# Altium project Pedal_SOM_MCU.PrjPcb
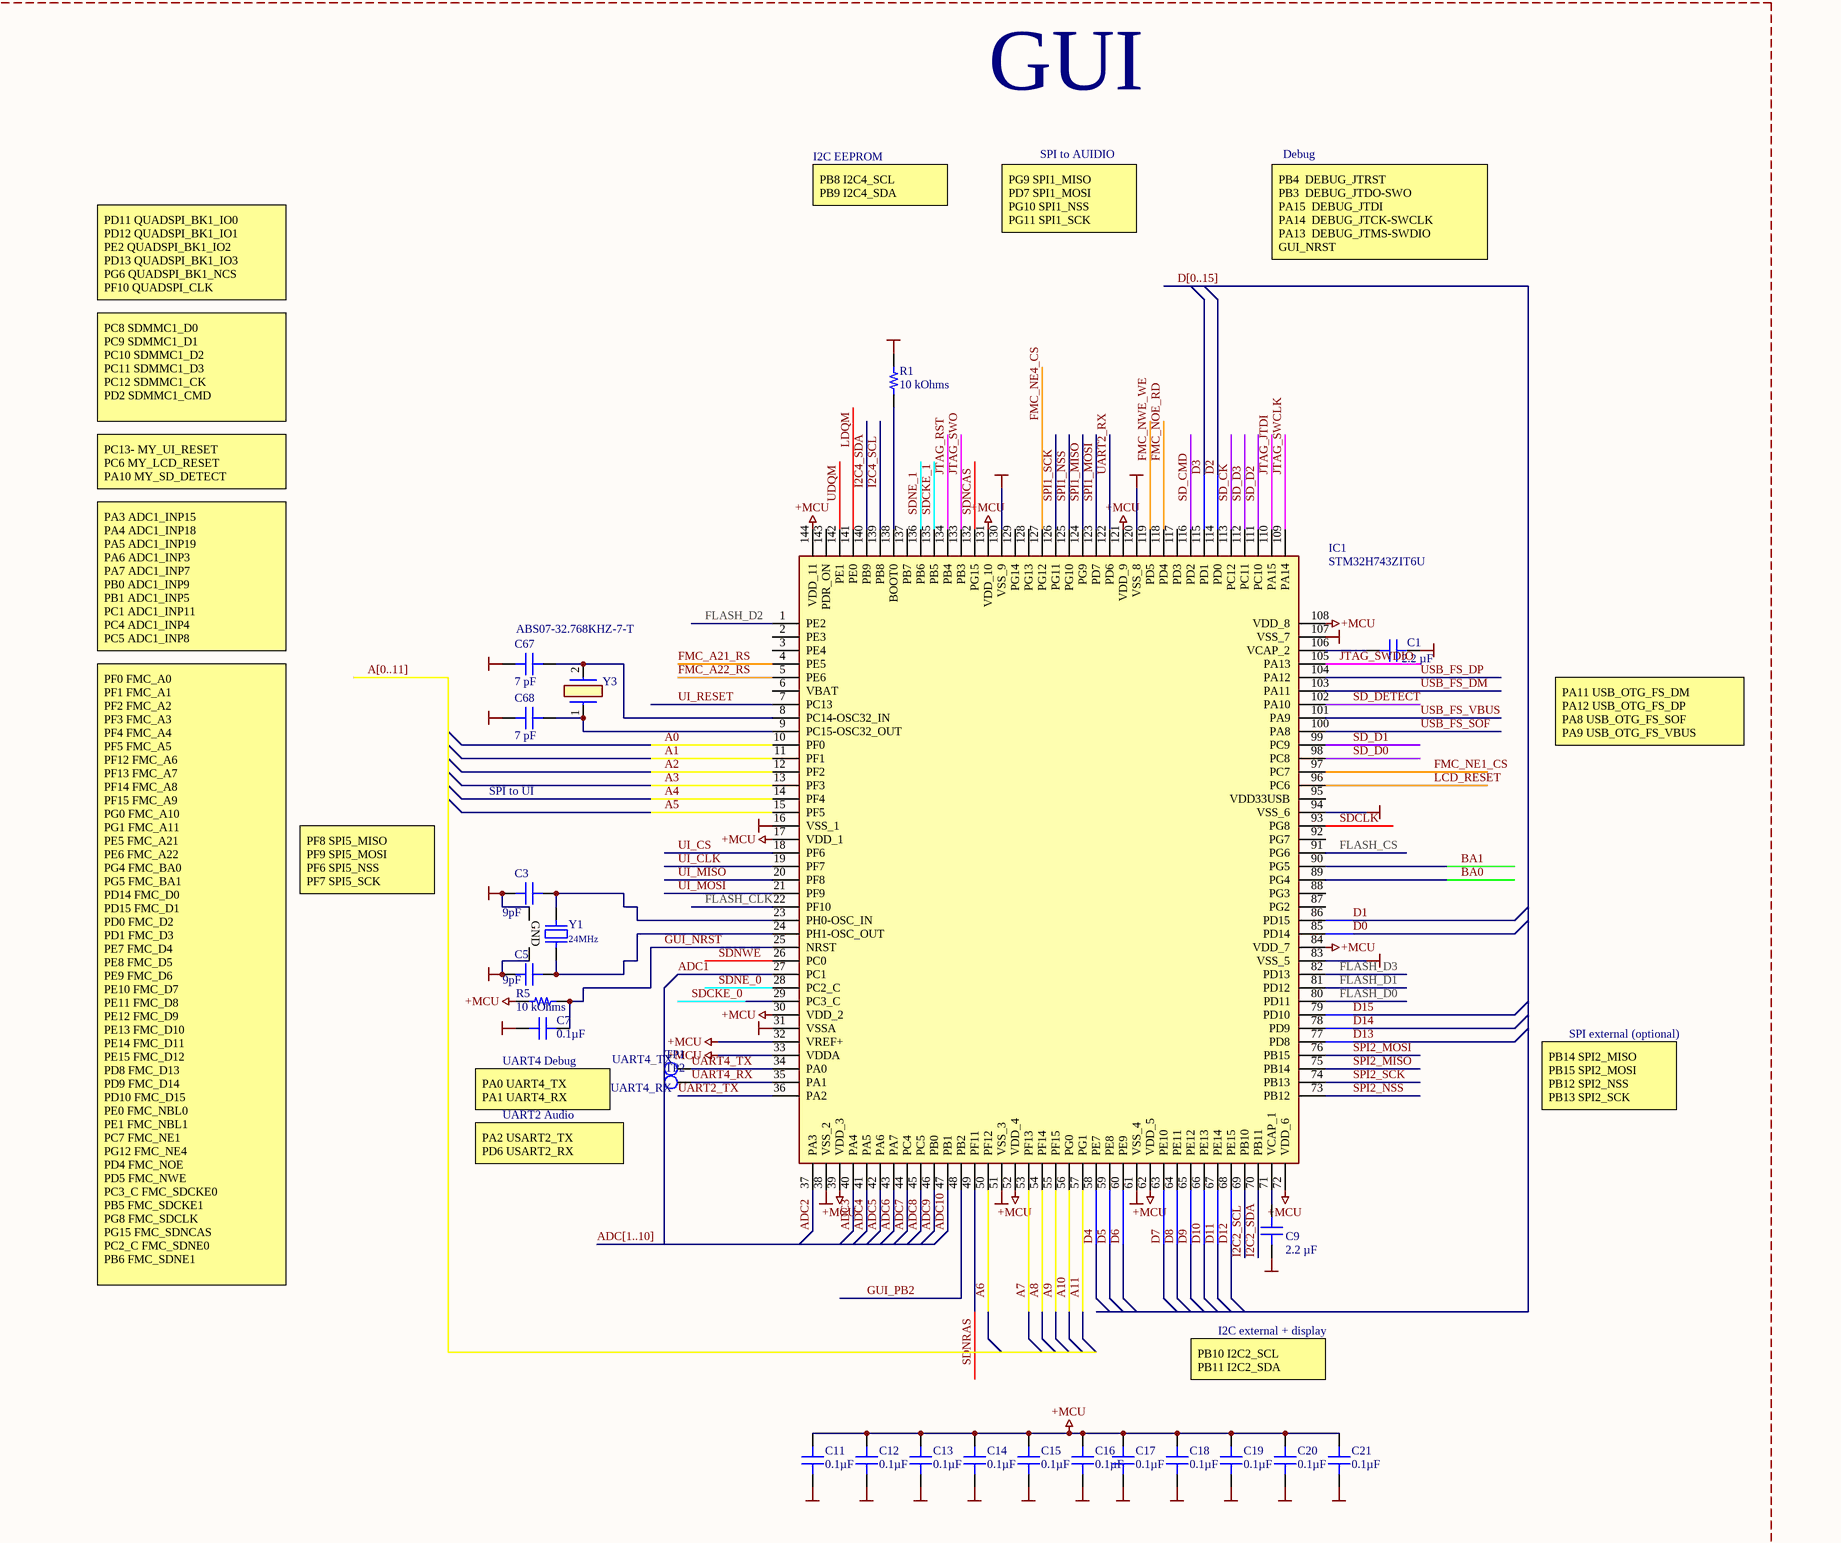
[diagram p0: SOM_MCU.SchDoc, top left]
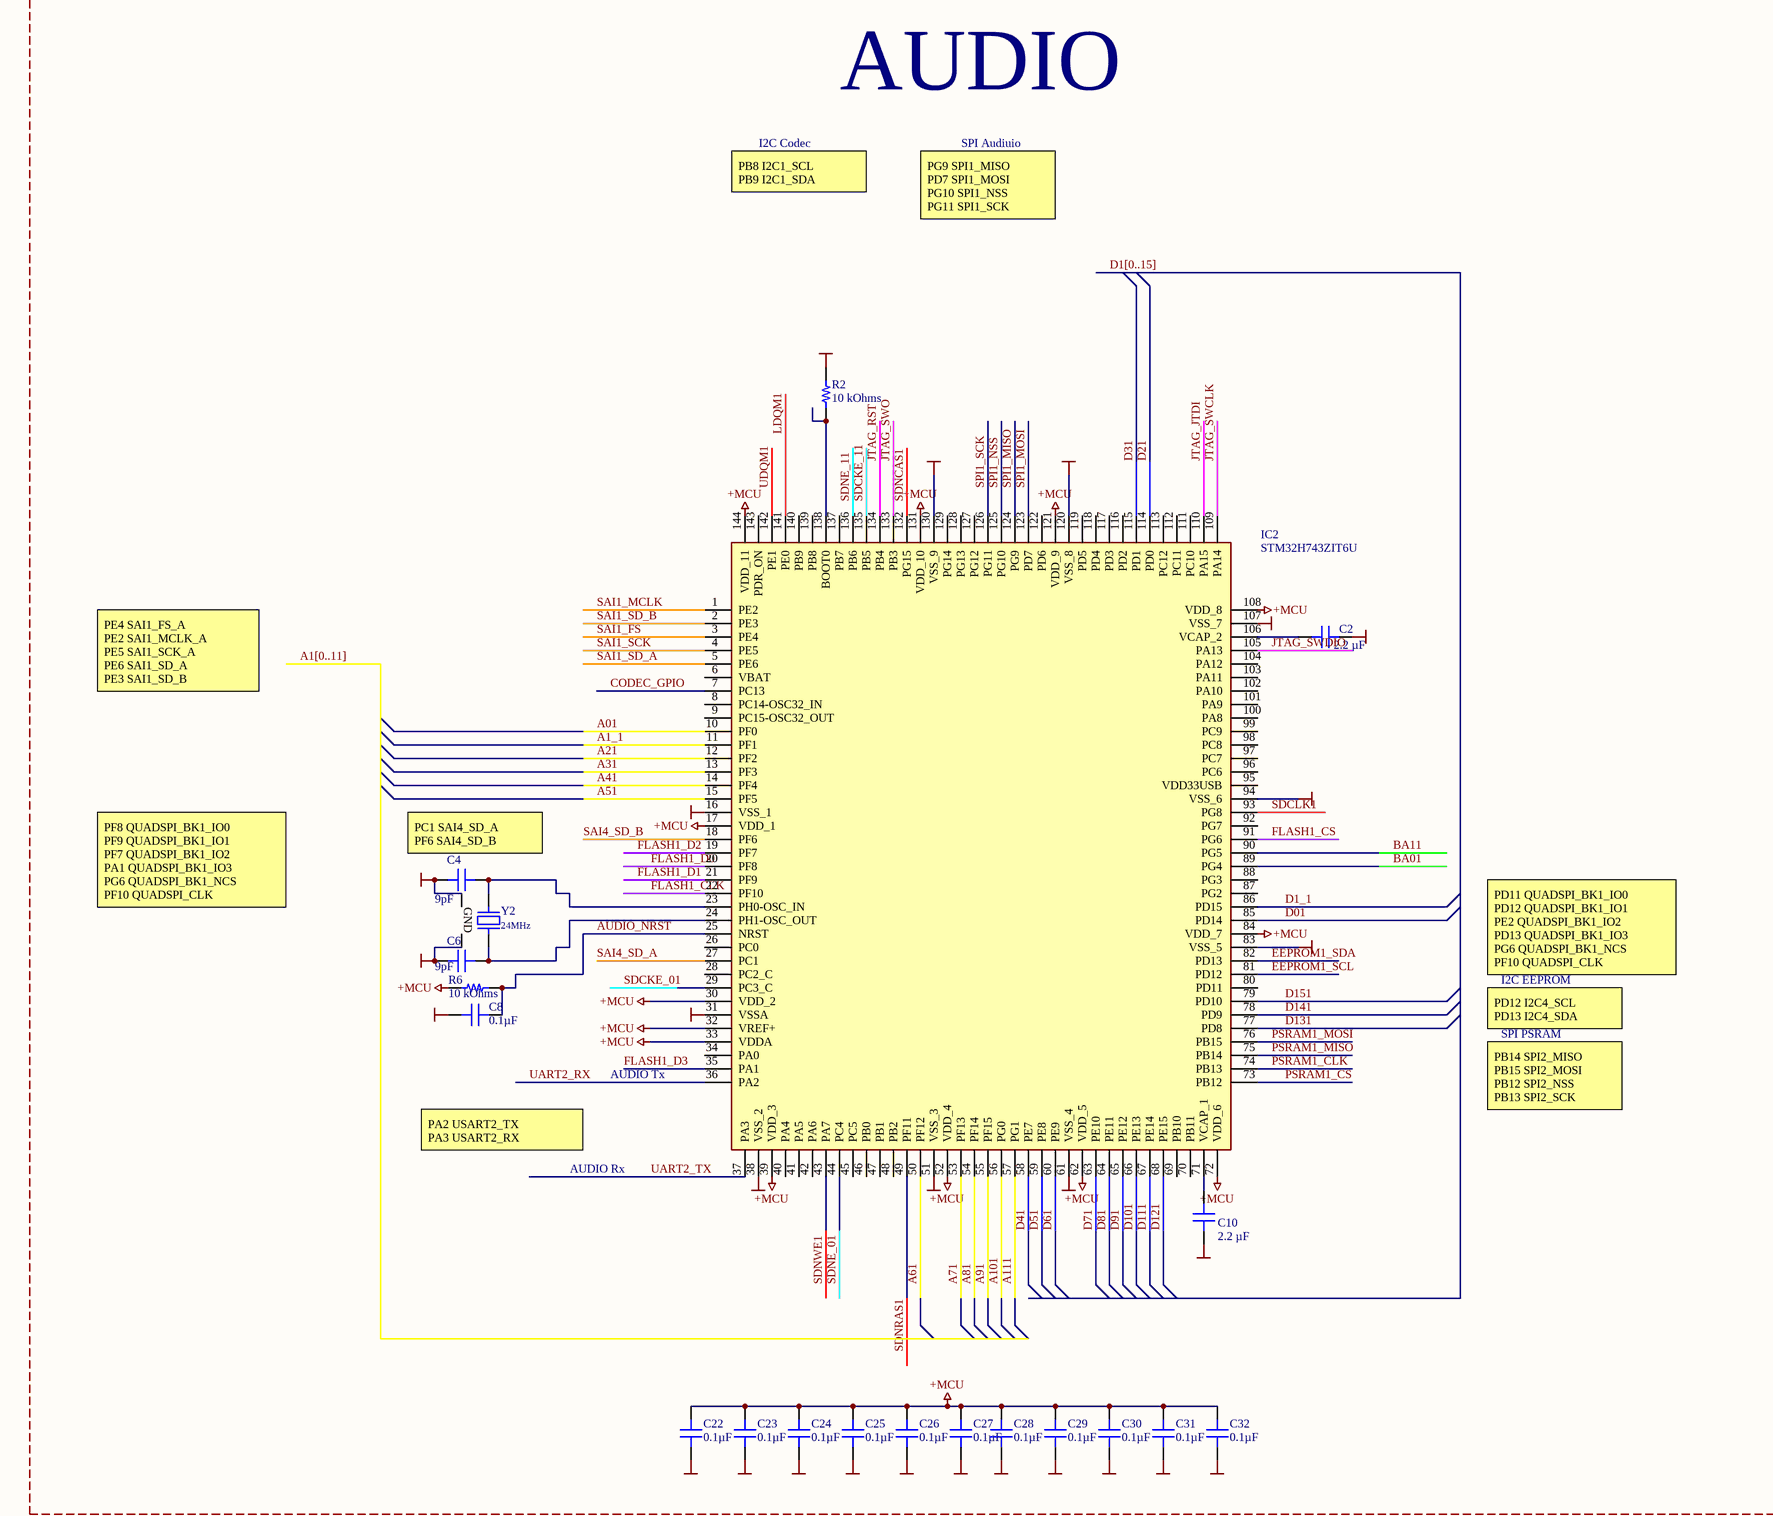
[diagram p1: SOM_MCU.SchDoc, top right]
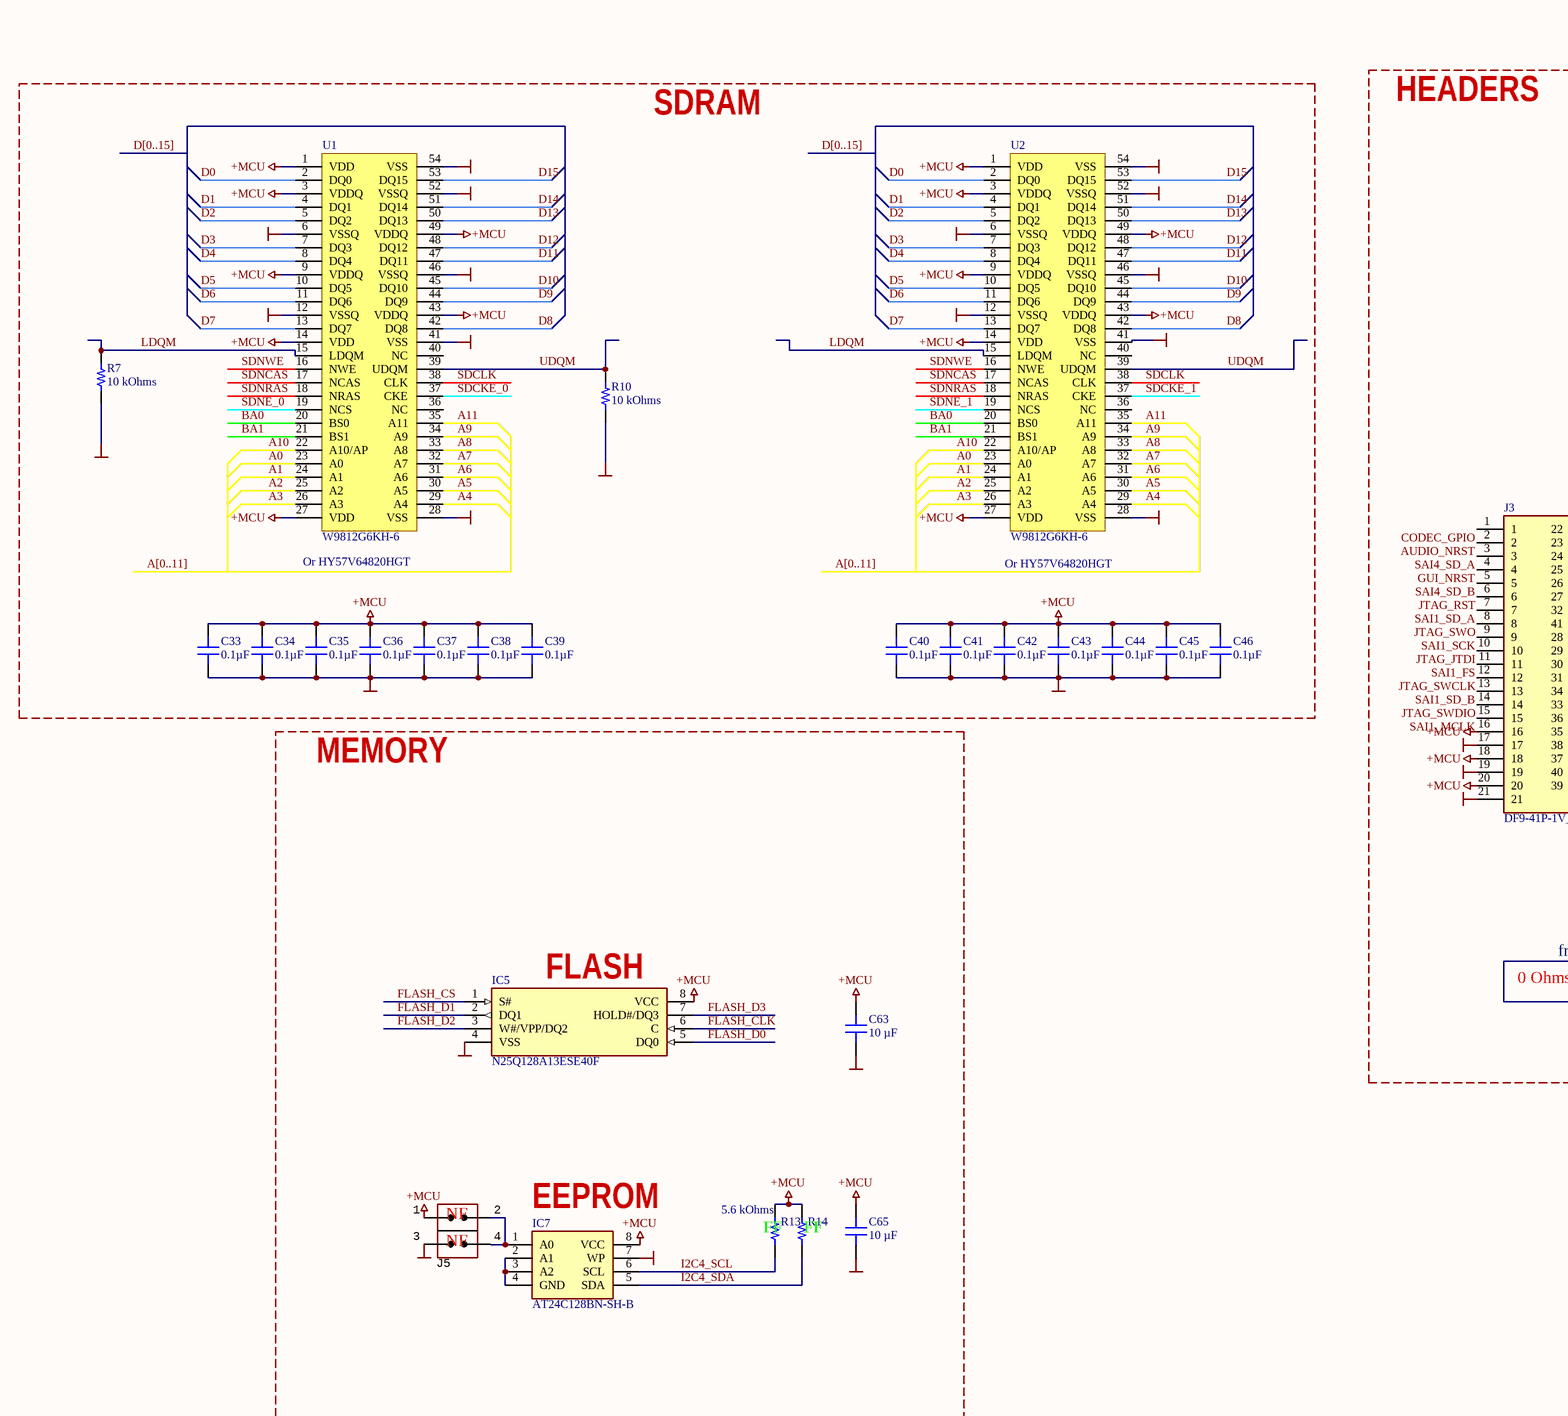
[diagram p2: SOM_MCU.SchDoc, bottom left]
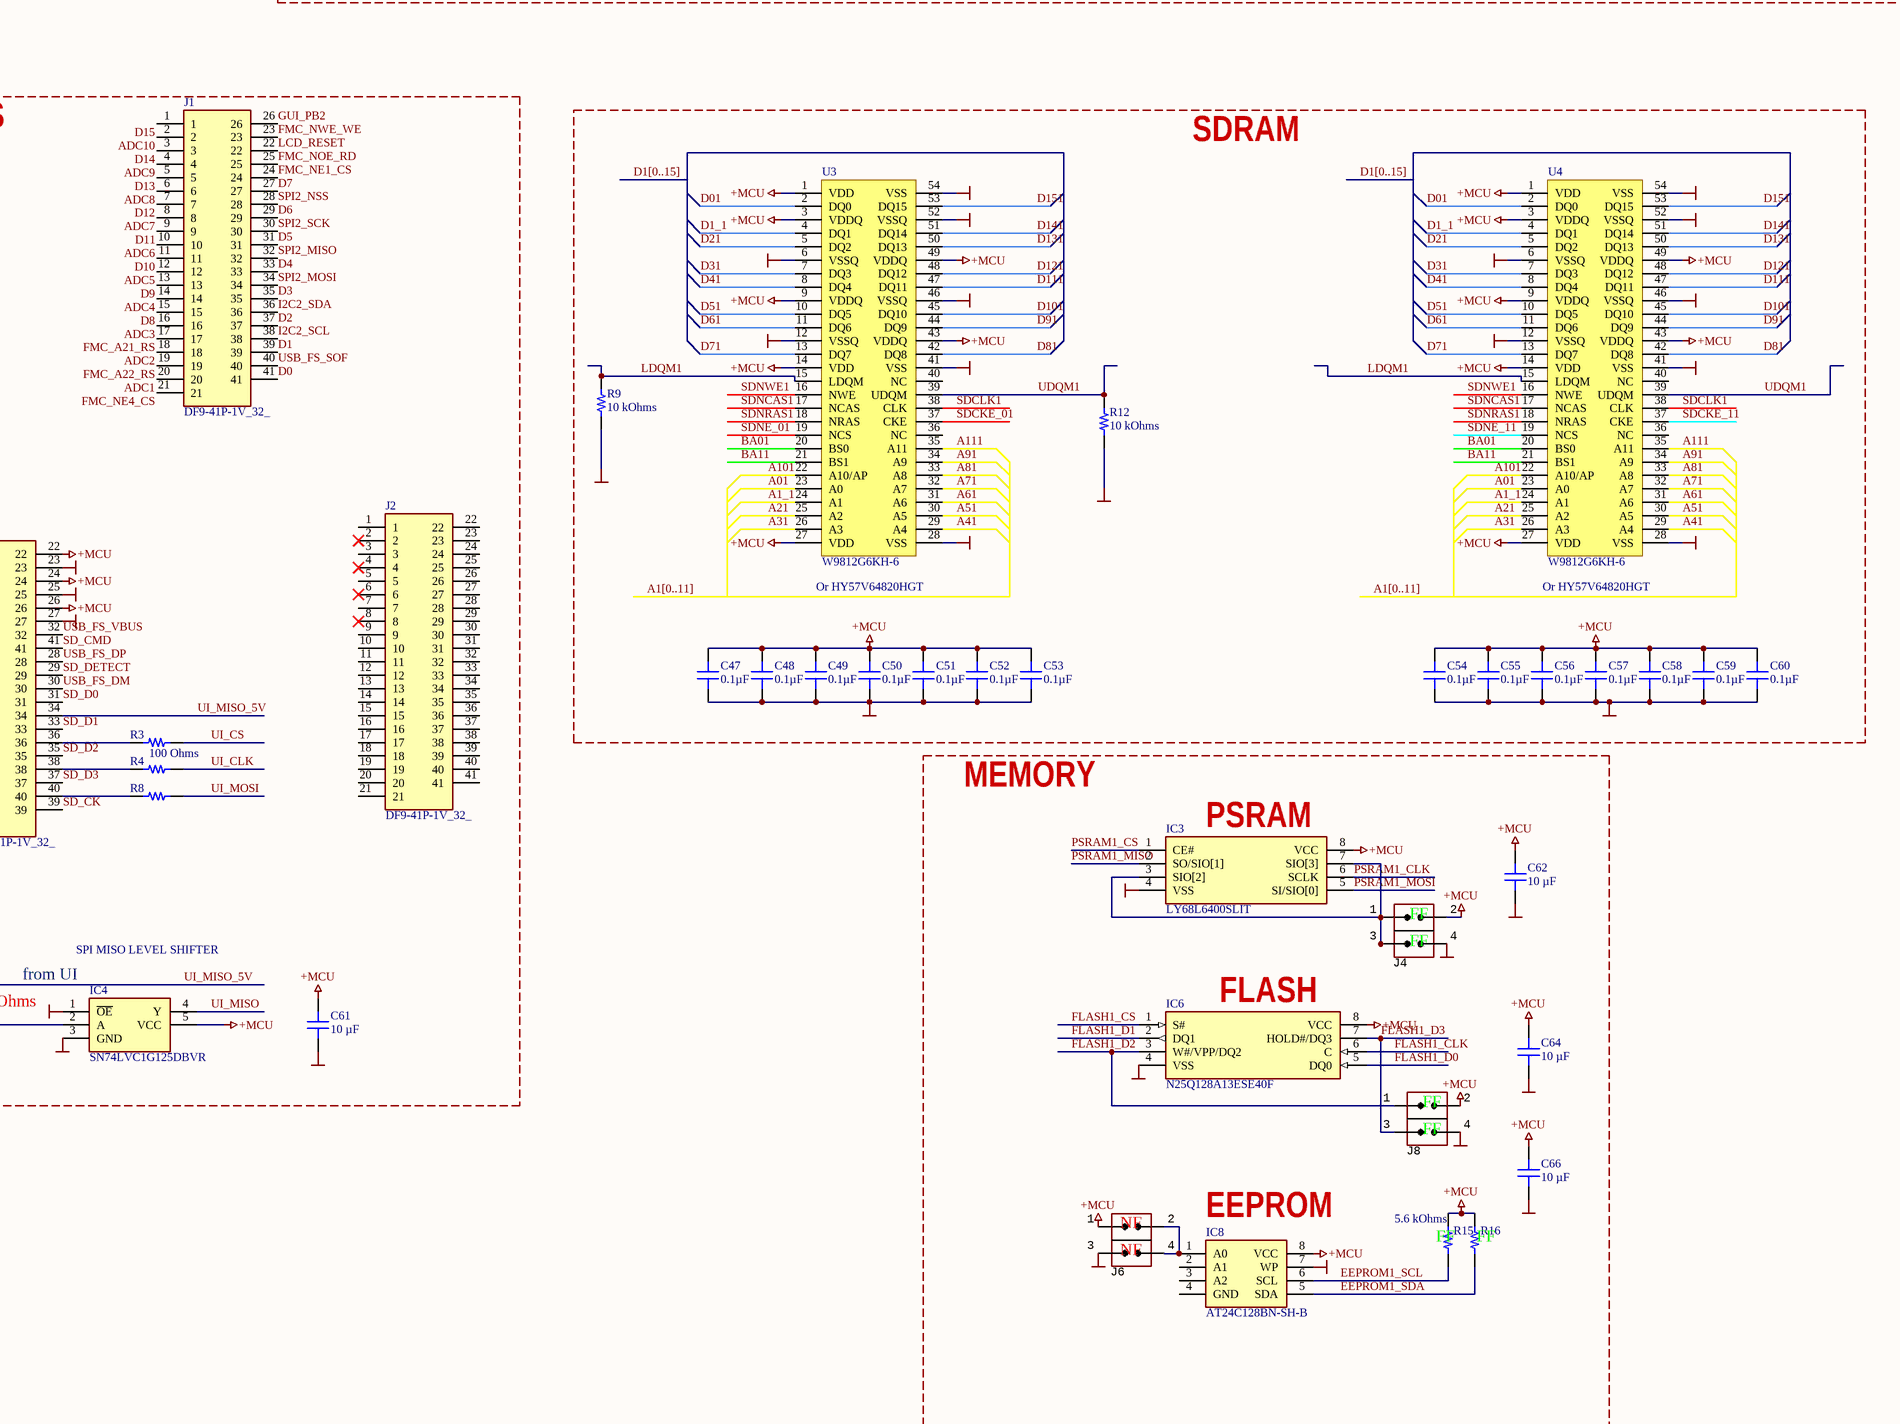
[diagram p3: SOM_MCU.SchDoc, bottom right]
1 sheet, 107 parts. Net scope: global (net labels, ports and power ports of the same name join across sheets).
Board files: SOM_MCU.PcbDoc, snapshots.PcbDoc, SOM_MCU_dual.PcbDoc

## Sheet SOM_MCU.SchDoc
size A0; SheetNumber: 1; SheetTotal: 1

### Parts
C1  2.2 µF  [CAP 0805_2012]
C2  2.2 µF  [CAP 0805_2012]
C3  9pF  [CAP 0805_2012]
C4  9pF  [CAP 0805_2012]
C5  9pF  [CAP 0805_2012]
C6  9pF  [CAP 0805_2012]
C7  0.1µF  [CAP 0402_1005]
C8  0.1µF  [CAP 0402_1005]
C9  2.2 µF  [CAP 0805_2012]
C10  2.2 µF  [CAP 0805_2012]
C11  0.1µF  [CAP 0402_1005]
C12  0.1µF  [CAP 0402_1005]
C13  0.1µF  [CAP 0402_1005]
C14  0.1µF  [CAP 0402_1005]
C15  0.1µF  [CAP 0402_1005]
C16  0.1µF  [CAP 0402_1005]
C17  0.1µF  [CAP 0402_1005]
C18  0.1µF  [CAP 0402_1005]
C19  0.1µF  [CAP 0402_1005]
C20  0.1µF  [CAP 0402_1005]
C21  0.1µF  [CAP 0402_1005]
C22  0.1µF  [CAP 0402_1005]
C23  0.1µF  [CAP 0402_1005]
C24  0.1µF  [CAP 0402_1005]
C25  0.1µF  [CAP 0402_1005]
C26  0.1µF  [CAP 0402_1005]
C27  0.1µF  [CAP 0402_1005]
C28  0.1µF  [CAP 0402_1005]
C29  0.1µF  [CAP 0402_1005]
C30  0.1µF  [CAP 0402_1005]
C31  0.1µF  [CAP 0402_1005]
C32  0.1µF  [CAP 0402_1005]
C33  0.1µF  [CAP 0402_1005]
C34  0.1µF  [CAP 0402_1005]
C35  0.1µF  [CAP 0402_1005]
C36  0.1µF  [CAP 0402_1005]
C37  0.1µF  [CAP 0402_1005]
C38  0.1µF  [CAP 0402_1005]
C39  0.1µF  [CAP 0402_1005]
C40  0.1µF  [CAP 0402_1005]
C41  0.1µF  [CAP 0402_1005]
C42  0.1µF  [CAP 0402_1005]
C43  0.1µF  [CAP 0402_1005]
C44  0.1µF  [CAP 0402_1005]
C45  0.1µF  [CAP 0402_1005]
C46  0.1µF  [CAP 0402_1005]
C47  0.1µF  [CAP 0402_1005]
C48  0.1µF  [CAP 0402_1005]
C49  0.1µF  [CAP 0402_1005]
C50  0.1µF  [CAP 0402_1005]
C51  0.1µF  [CAP 0402_1005]
C52  0.1µF  [CAP 0402_1005]
C53  0.1µF  [CAP 0402_1005]
C54  0.1µF  [CAP 0402_1005]
C55  0.1µF  [CAP 0402_1005]
C56  0.1µF  [CAP 0402_1005]
C57  0.1µF  [CAP 0402_1005]
C58  0.1µF  [CAP 0402_1005]
C59  0.1µF  [CAP 0402_1005]
C60  0.1µF  [CAP 0402_1005]
C61  10 µF  [CAP 0805_2012]
C62  10 µF  [CAP 0805_2012]
C63  10 µF  [CAP 0805_2012]
C64  10 µF  [CAP 0805_2012]
C65  10 µF  [CAP 0805_2012]
C66  10 µF  [CAP 0805_2012]
C67  7 pF  [CAP 0805_2012]
C68  7 pF  [CAP 0805_2012]
IC1  STM32H743ZIT6U  [QFP50P2200X2200X160-144N]
IC2  STM32H743ZIT6U  [QFP50P2200X2200X160-144N]
IC3  LY68L6400SLIT  [SOIC127P600X175-8N]
IC4  SN74LVC1G125DBVR  [SOT95P280X145-5N]
IC5  N25Q128A13ESE40F  [SOIC127P790X216-8N]
IC6  N25Q128A13ESE40F  [SOIC127P790X216-8N]
IC7  AT24C128BN-SH-B  [SOIC127P600X175-8N]
IC8  AT24C128BN-SH-B  [SOIC127P600X175-8N]
J1  DF9-41P-1V_32_  [HIROSE_DF9-41P-1V(32)]
J2  DF9-41P-1V_32_  [HIROSE_DF9-41P-1V(32)]
J3  DF9-41P-1V_32_  [HIROSE_DF9-41P-1V(32)]
J4  (no value)  [CON: JUMPER x2]
J5  (no value)  [CON: JUMPER x2]
J6  (no value)  [CON: JUMPER x2]
J8  (no value)  [CON: JUMPER x2]
R1  10 kOhms  [RES 0603_1608]
R2  10 kOhms  [RES 0603_1608]
R3  100 Ohms  [RES 0402_1005]
R4  100 Ohms  [RES 0402_1005]  (value not drawn)
R5  10 kOhms  [RES 0603_1608]
R6  10 kOhms  [RES 0603_1608]
R7  10 kOhms  [RES 0603_1608]
R8  100 Ohms  [RES 0402_1005]  (value not drawn)
R9  10 kOhms  [RES 0603_1608]
R10  10 kOhms  [RES 0603_1608]
R12  10 kOhms  [RES 0603_1608]
R13  5.6 kOhms  [RES 0603_1608]
R14  5.6 kOhms  [RES 0603_1608]  (value not drawn)
R15  5.6 kOhms  [RES 0603_1608]
R16  5.6 kOhms  [RES 0603_1608]  (value not drawn)
TP1  UART4_TX  [TESTPOINT_VIA]
TP2  UART4_RX  [TESTPOINT_VIA]
U1  W9812G6KH-6  [TSOP-54]
U2  W9812G6KH-6  [TSOP-54]
U3  W9812G6KH-6  [TSOP-54]
U4  W9812G6KH-6  [TSOP-54]
Y1  24MHz  [NDK NX3225SA]
Y2  24MHz  [NDK NX3225SA]
Y3  ABS07-32.768KHZ-7-T  [ABS07]

### Blocks framed on the sheet
AUDIO: C2 C4 C6 C8 C10 C22-C32 IC2 R2 R6 Y2
GUI: C1 C3 C5 C7 C9 C11-C21 C67 C68 IC1 R1 R5 TP1 TP2 Y1 Y3
SDRAM: C33-C46 R7 R10 U1 U2
HEADERS: C61 IC4 J1-J3 R3 R4 R8
SDRAM: C47-C60 R9 R12 U3 U4

### Nets
+MCU: C11.1 C12.1 C13.1 C14.1 C15.1 C16.1 C17.1 C18.1 C19.1 C20.1 C21.1 C22.1 C23.1 C24.1 C25.1 C26.1 C27.1 C28.1 C29.1 C30.1 C31.1 C32.1 C33.1 C34.1 C35.1 C36.1 C37.1 C38.1 C39.1 C40.1 C41.1 C42.1 C43.1 C44.1 C45.1 C46.1 C47.1 C48.1 C49.1 C50.1 C51.1 C52.1 C53.1 C54.1 C55.1 C56.1 C57.1 C58.1 C59.1 C60.1 C61.2 C62.2 C63.2 C64.2 C65.2 C66.2 IC1.17(VDD_1) IC1.30(VDD_2) IC1.32(VREF+) IC1.33(VDDA) IC1.39(VDD_3) IC1.52(VDD_4) IC1.62(VDD_5) IC1.72(VDD_6) IC1.84(VDD_7) IC1.108(VDD_8) IC1.121(VDD_9) IC1.131(VDD_10) IC1.144(VDD_11) IC2.17(VDD_1) IC2.30(VDD_2) IC2.32(VREF+) IC2.33(VDDA) IC2.39(VDD_3) IC2.52(VDD_4) IC2.62(VDD_5) IC2.72(VDD_6) IC2.84(VDD_7) IC2.108(VDD_8) IC2.121(VDD_9) IC2.131(VDD_10) IC2.144(VDD_11) IC3.8(VCC) IC4.5(VCC) IC5.8(VCC) IC6.8(VCC) IC7.8(VCC) IC8.8(VCC) J3.16 J3.18 J3.20 J3.22 J3.24 J3.26 J4.2(IN) J5.1(IN) J6.1(IN) J8.2(IN) R5.1 R6.1 R13.2 R14.2 R15.2 R16.2 U1.1(VDD) U1.3(VDDQ) U1.9(VDDQ) U1.14(VDD) U1.27(VDD) U1.43(VDDQ) U1.49(VDDQ) U2.1(VDD) U2.3(VDDQ) U2.9(VDDQ) U2.14(VDD) U2.27(VDD) U2.43(VDDQ) U2.49(VDDQ) U3.1(VDD) U3.3(VDDQ) U3.9(VDDQ) U3.14(VDD) U3.27(VDD) U3.43(VDDQ) U3.49(VDDQ) U4.1(VDD) U4.3(VDDQ) U4.9(VDDQ) U4.14(VDD) U4.27(VDD) U4.43(VDDQ) U4.49(VDDQ)
GND: C1.2 C2.2 C3.1 C4.1 C5.1 C6.1 C7.1 C8.1 C9.1 C10.1 C11.2 C12.2 C13.2 C14.2 C15.2 C16.2 C17.2 C18.2 C19.2 C20.2 C21.2 C22.2 C23.2 C24.2 C25.2 C26.2 C27.2 C28.2 C29.2 C30.2 C31.2 C32.2 C33.2 C34.2 C35.2 C36.2 C37.2 C38.2 C39.2 C40.2 C41.2 C42.2 C43.2 C44.2 C45.2 C46.2 C47.2 C48.2 C49.2 C50.2 C51.2 C52.2 C53.2 C54.2 C55.2 C56.2 C57.2 C58.2 C59.2 C60.2 C61.1 C62.1 C63.1 C64.1 C65.1 C66.1 C67.1 C68.1 IC1.16(VSS_1) IC1.31(VSSA) IC1.38(VSS_2) IC1.51(VSS_3) IC1.61(VSS_4) IC1.83(VSS_5) IC1.94(VSS_6) IC1.107(VSS_7) IC1.120(VSS_8) IC1.130(VSS_9) IC2.16(VSS_1) IC2.31(VSSA) IC2.38(VSS_2) IC2.51(VSS_3) IC2.61(VSS_4) IC2.83(VSS_5) IC2.94(VSS_6) IC2.107(VSS_7) IC2.120(VSS_8) IC2.130(VSS_9) IC3.4(VSS) IC4.1(~{OE}) IC4.3(GND) IC5.4(VSS) IC6.4(VSS) IC7.7(WP) IC8.7(WP) J3.17 J3.19 J3.21 J3.23 J3.25 J3.27 J4.4(IN) J5.3(IN) J6.3(IN) J8.4(IN) R1.2 R2.2 R7.1 R9.1 R10.1 R12.1 U1.6(VSSQ) U1.12(VSSQ) U1.28(VSS) U1.41(VSS) U1.46(VSSQ) U1.52(VSSQ) U1.54(VSS) U2.6(VSSQ) U2.12(VSSQ) U2.28(VSS) U2.41(VSS) U2.46(VSSQ) U2.52(VSSQ) U2.54(VSS) U3.6(VSSQ) U3.12(VSSQ) U3.28(VSS) U3.41(VSS) U3.46(VSSQ) U3.52(VSSQ) U3.54(VSS) U4.6(VSSQ) U4.12(VSSQ) U4.28(VSS) U4.41(VSS) U4.46(VSSQ) U4.52(VSSQ) U4.54(VSS) Y1.2(GND) Y1.4(GND) Y2.2(GND) Y2.4(GND)
A0: IC1.10(PF0) U1.23(A0) U2.23(A0)
A1: IC1.11(PF1) U1.24(A1) U2.24(A1)
A01: IC2.10(PF0) U3.23(A0) U4.23(A0)
A1_1: IC2.11(PF1) U3.24(A1) U4.24(A1)
A2: IC1.12(PF2) U1.25(A2) U2.25(A2)
A3: IC1.13(PF3) U1.26(A3) U2.26(A3)
A4: IC1.14(PF4) U1.29(A4) U2.29(A4)
A5: IC1.15(PF5) U1.30(A5) U2.30(A5)
A6: IC1.50(PF12) U1.31(A6) U2.31(A6)
A7: IC1.53(PF13) U1.32(A7) U2.32(A7)
A8: IC1.54(PF14) U1.33(A8) U2.33(A8)
A9: IC1.55(PF15) U1.34(A9) U2.34(A9)
A10: IC1.56(PG0) U1.22(A10/AP) U2.22(A10/AP)
A11: IC1.57(PG1) U1.35(A11) U2.35(A11)
A21: IC2.12(PF2) U3.25(A2) U4.25(A2)
A31: IC2.13(PF3) U3.26(A3) U4.26(A3)
A41: IC2.14(PF4) U3.29(A4) U4.29(A4)
A51: IC2.15(PF5) U3.30(A5) U4.30(A5)
A61: IC2.50(PF12) U3.31(A6) U4.31(A6)
A71: IC2.53(PF13) U3.32(A7) U4.32(A7)
A81: IC2.54(PF14) U3.33(A8) U4.33(A8)
A91: IC2.55(PF15) U3.34(A9) U4.34(A9)
A101: IC2.56(PG0) U3.22(A10/AP) U4.22(A10/AP)
A111: IC2.57(PG1) U3.35(A11) U4.35(A11)
ADC1: IC1.27(PC1) J1.20
ADC2: IC1.37(PA3) J1.18
ADC3: IC1.40(PA4) J1.16
ADC4: IC1.41(PA5) J1.14
ADC5: IC1.42(PA6) J1.12
ADC6: IC1.43(PA7) J1.10
ADC7: IC1.44(PC4) J1.8
ADC8: IC1.45(PC5) J1.6
ADC9: IC1.46(PB0) J1.4
ADC10: IC1.47(PB1) J1.2
AUDIO_NRST: C8.2 IC2.25(NRST) J3.2 R6.2
BA0: IC1.89(PG4) U1.20(BS0) U2.20(BS0)
BA1: IC1.90(PG5) U1.21(BS1) U2.21(BS1)
BA01: IC2.89(PG4) U3.20(BS0) U4.20(BS0)
BA11: IC2.90(PG5) U3.21(BS1) U4.21(BS1)
CODEC_GPIO: IC2.7(PC13) J3.1
D0: IC1.85(PD14) J1.41 U1.2(DQ0) U2.2(DQ0)
D1: IC1.86(PD15) J1.39 U1.4(DQ1) U2.4(DQ1)
D01: IC2.85(PD14) U3.2(DQ0) U4.2(DQ0)
D1_1: IC2.86(PD15) U3.4(DQ1) U4.4(DQ1)
D2: IC1.114(PD0) J1.37 U1.5(DQ2) U2.5(DQ2)
D3: IC1.115(PD1) J1.35 U1.7(DQ3) U2.7(DQ3)
D4: IC1.58(PE7) J1.33 U1.8(DQ4) U2.8(DQ4)
D5: IC1.59(PE8) J1.31 U1.10(DQ5) U2.10(DQ5)
D6: IC1.60(PE9) J1.29 U1.11(DQ6) U2.11(DQ6)
D7: IC1.63(PE10) J1.27 U1.13(DQ7) U2.13(DQ7)
D8: IC1.64(PE11) J1.15 U1.42(DQ8) U2.42(DQ8)
D9: IC1.65(PE12) J1.13 U1.44(DQ9) U2.44(DQ9)
D10: IC1.66(PE13) J1.11 U1.45(DQ10) U2.45(DQ10)
D11: IC1.67(PE14) J1.9 U1.47(DQ11) U2.47(DQ11)
D12: IC1.68(PE15) J1.7 U1.48(DQ12) U2.48(DQ12)
D13: IC1.77(PD8) J1.5 U1.50(DQ13) U2.50(DQ13)
D14: IC1.78(PD9) J1.3 U1.51(DQ14) U2.51(DQ14)
D15: IC1.79(PD10) J1.1 U1.53(DQ15) U2.53(DQ15)
D21: IC2.114(PD0) U3.5(DQ2) U4.5(DQ2)
D31: IC2.115(PD1) U3.7(DQ3) U4.7(DQ3)
D41: IC2.58(PE7) U3.8(DQ4) U4.8(DQ4)
D51: IC2.59(PE8) U3.10(DQ5) U4.10(DQ5)
D61: IC2.60(PE9) U3.11(DQ6) U4.11(DQ6)
D71: IC2.63(PE10) U3.13(DQ7) U4.13(DQ7)
D81: IC2.64(PE11) U3.42(DQ8) U4.42(DQ8)
D91: IC2.65(PE12) U3.44(DQ9) U4.44(DQ9)
D101: IC2.66(PE13) U3.45(DQ10) U4.45(DQ10)
D111: IC2.67(PE14) U3.47(DQ11) U4.47(DQ11)
D121: IC2.68(PE15) U3.48(DQ12) U4.48(DQ12)
D131: IC2.77(PD8) U3.50(DQ13) U4.50(DQ13)
D141: IC2.78(PD9) U3.51(DQ14) U4.51(DQ14)
D151: IC2.79(PD10) U3.53(DQ15) U4.53(DQ15)
EEPROM1_SCL: IC2.81(PD12) IC8.6(SCL) R15.1
EEPROM1_SDA: IC2.82(PD13) IC8.5(SDA) R16.1
FLASH1_CLK: IC2.22(PF10) IC6.6(C)
FLASH1_CS: IC2.91(PG6) IC6.1(S#)
FLASH1_D0: IC2.20(PF8) IC6.5(DQ0)
FLASH1_D1: IC2.21(PF9) IC6.2(DQ1)
FLASH1_D2: IC2.19(PF7) IC6.3(W#/VPP/DQ2) J8.1(IN)
FLASH1_D3: IC2.35(PA1) IC6.7(HOLD#/DQ3) J8.3(IN)
FLASH_CLK: IC1.22(PF10) IC5.6(C)
FLASH_CS: IC1.91(PG6) IC5.1(S#)
FLASH_D0: IC1.80(PD11) IC5.5(DQ0)
FLASH_D1: IC1.81(PD12) IC5.2(DQ1)
FLASH_D2: IC1.1(PE2) IC5.3(W#/VPP/DQ2)
FLASH_D3: IC1.82(PD13) IC5.7(HOLD#/DQ3)
FMC_A21_RS: IC1.4(PE5) J1.17
FMC_A22_RS: IC1.5(PE6) J1.19
FMC_NE1_CS: IC1.97(PC7) J1.24
FMC_NE4_CS: IC1.127(PG12) J1.21
FMC_NOE_RD: IC1.118(PD4) J1.25
FMC_NWE_WE: IC1.119(PD5) J1.23
GUI_NRST: C7.2 IC1.25(NRST) J3.4 R5.2
GUI_PB2: IC1.48(PB2) J1.26
I2C2_SCL: IC1.69(PB10) J1.38
I2C2_SDA: IC1.70(PB11) J1.36
I2C4_SCL: IC1.139(PB8) IC7.6(SCL) R13.1
I2C4_SDA: IC1.140(PB9) IC7.5(SDA) R14.1
JTAG_JTDI: IC1.110(PA15) IC2.110(PA15) J3.10
JTAG_RST: IC1.134(PB4) IC2.134(PB4) J3.6
JTAG_SWCLK: IC1.109(PA14) IC2.109(PA14) J3.12
JTAG_SWDIO: IC1.105(PA13) IC2.105(PA13) J3.14
JTAG_SWO: IC1.133(PB3) IC2.133(PB3) J3.8
LCD_RESET: IC1.96(PC6) J1.22
LDQM: IC1.141(PE0) R7.2 U1.15(LDQM) U2.15(LDQM)
LDQM1: IC2.141(PE0) R9.2 U3.15(LDQM) U4.15(LDQM)
PSRAM1_CLK: IC2.74(PB13) IC3.6(SCLK)
PSRAM1_CS: IC2.73(PB12) IC3.1(CE#)
PSRAM1_MISO: IC2.75(PB14) IC3.2(SO/SIO[1])
PSRAM1_MOSI: IC2.76(PB15) IC3.5(SI/SIO[0])
SAI1_FS: IC2.3(PE4) J3.11
SAI1_MCLK: IC2.1(PE2) J3.15
SAI1_SCK: IC2.4(PE5) J3.9
SAI1_SD_A: IC2.5(PE6) J3.7
SAI1_SD_B: IC2.2(PE3) J3.13
SAI4_SD_A: IC2.27(PC1) J3.3
SAI4_SD_B: IC2.18(PF6) J3.5
SD_CK: IC1.113(PC12) J3.39
SD_CMD: IC1.116(PD2) J3.41
SD_D0: IC1.98(PC8) J3.31
SD_D1: IC1.99(PC9) J3.33
SD_D2: IC1.111(PC10) J3.35
SD_D3: IC1.112(PC11) J3.37
SD_DETECT: IC1.102(PA10) J3.29
SDCKE_0: IC1.29(PC3_C) U1.37(CKE)
SDCKE_1: IC1.135(PB5) U2.37(CKE)
SDCKE_01: IC2.29(PC3_C) U3.37(CKE)
SDCKE_11: IC2.135(PB5) U4.37(CKE)
SDCLK: IC1.93(PG8) U1.38(CLK) U2.38(CLK)
SDCLK1: IC2.93(PG8) U3.38(CLK) U4.38(CLK)
SDNCAS: IC1.132(PG15) U1.17(NCAS) U2.17(NCAS)
SDNCAS1: IC2.132(PG15) U3.17(NCAS) U4.17(NCAS)
SDNE_0: IC1.28(PC2_C) U1.19(NCS)
SDNE_1: IC1.136(PB6) U2.19(NCS)
SDNE_01: IC2.44(PC4) U3.19(NCS)
SDNE_11: IC2.136(PB6) U4.19(NCS)
SDNRAS: IC1.49(PF11) U1.18(NRAS) U2.18(NRAS)
SDNRAS1: IC2.49(PF11) U3.18(NRAS) U4.18(NRAS)
SDNWE: IC1.26(PC0) U1.16(NWE) U2.16(NWE)
SDNWE1: IC2.43(PA7) U3.16(NWE) U4.16(NWE)
SPI1_MISO: IC1.124(PG9) IC2.124(PG9)
SPI1_MOSI: IC1.123(PD7) IC2.123(PD7)
SPI1_NSS: IC1.125(PG10) IC2.125(PG10)
SPI1_SCK: IC1.126(PG11) IC2.126(PG11)
SPI2_MISO: IC1.75(PB14) J1.32
SPI2_MOSI: IC1.76(PB15) J1.34
SPI2_NSS: IC1.73(PB12) J1.28
SPI2_SCK: IC1.74(PB13) J1.30
UART2_RX: IC1.122(PD6) IC2.36(PA2)
UART2_TX: IC1.36(PA2) IC2.37(PA3)
UART4_RX: IC1.35(PA1) TP2.1
UART4_TX: IC1.34(PA0) TP1.1
UDQM: IC1.142(PE1) R10.2 U1.39(UDQM) U2.39(UDQM)
UDQM1: IC2.142(PE1) R12.2 U3.39(UDQM) U4.39(UDQM)
UI_CLK: IC1.19(PF7) R4.2
UI_CS: IC1.18(PF6) R3.2
UI_MISO: IC1.20(PF8) IC4.4(Y)
UI_MISO_5V: IC4.2(A) J3.34
UI_MOSI: IC1.21(PF9) R8.2
UI_RESET: IC1.7(PC13)
USB_FS_DM: IC1.103(PA11) J3.30
USB_FS_DP: IC1.104(PA12) J3.28
USB_FS_SOF: IC1.100(PA8) J1.40
USB_FS_VBUS: IC1.101(PA9) J3.32
NetC1_1: C1.1 IC1.106(VCAP_2)
NetC2_1: C2.1 IC2.106(VCAP_2)
NetC3_2: C3.2 IC1.23(PH0-OSC_IN) Y1.1
NetC4_2: C4.2 IC2.23(PH0-OSC_IN) Y2.1
NetC5_2: C5.2 IC1.24(PH1-OSC_OUT) Y1.3
NetC6_2: C6.2 IC2.24(PH1-OSC_OUT) Y2.3
NetC9_2: C9.2 IC1.71(VCAP_1)
NetC10_2: C10.2 IC2.71(VCAP_1)
NetC67_2: C67.2 IC1.8(PC14-OSC32_IN) Y3.2
NetC68_2: C68.2 IC1.9(PC15-OSC32_OUT) Y3.1
NetIC1_138: IC1.138(BOOT0) R1.1
NetIC2_138: IC2.138(BOOT0) R2.1
NetIC3_3: IC3.3(SIO[2]) IC3.7(SIO[3]) J4.1(IN) J4.3(IN)
NetIC7_1: IC7.1(A0) J5.2(IN) J5.4(IN)
NetIC7_2: IC7.2(A1) IC7.3(A2) IC7.4(GND)
NetIC8_1: IC8.1(A0) J6.2(IN) J6.4(IN)
NetJ3_36: J3.36 R3.1
NetJ3_38: J3.38 R4.1
NetJ3_40: J3.40 R8.1

Not connected (* = marked no-connect by the designer): IC1 2(PE3) 3(PE4) 6(VBAT) 87(PG2) 88(PG3) 92(PG7) 95(VDD33USB) 117(PD3) 128(PG13) 129(PG14) 137(PB7) 143(PDR_ON); IC2 6(VBAT) 8(PC14-OSC32_IN) 9(PC15-OSC32_OUT) 26(PC0) 28(PC2_C) 34(PA0) 40(PA4) 41(PA5) 42(PA6) 45(PC5) 46(PB0) 47(PB1) 48(PB2) 69(PB10) 70(PB11) 80(PD11) 87(PG2) 88(PG3) 92(PG7) 95(VDD33USB) 96(PC6) 97(PC7) 98(PC8) 99(PC9) 100(PA8) 101(PA9) 102(PA10) 103(PA11) 104(PA12) 111(PC10) 112(PC11) 113(PC12) 116(PD2) 117(PD3) 118(PD4) 119(PD5) 122(PD6) 127(PG12) 128(PG13) 129(PG14) 137(PB7) 139(PB8) 140(PB9) 143(PDR_ON); IC8 2(A1) 3(A2) 4(GND); J2 1 2* 3 4* 5 6* 7 8* 9 10 11 12 13 14 15 16 17 18 19 20 21 22 23 24 25 26 27 28 29 30 31 32 33 34 35 36 37 38 39 40 41; U1 36(NC) 40(NC); U2 36(NC) 40(NC); U3 36(NC) 40(NC); U4 36(NC) 40(NC)

### Buses and harness runs
bus A1[0..11]
bus A[0..11]
bus ADC[1..10]
bus D1[0..15]
bus D[0..15]

### Notes on the sheet
- I2C EEPROM
- PB8	I2C4_SCL
  PB9	I2C4_SDA
- Disp SPI optional
- SPI to AUIDIO
- Debug
- PB8	I2C1_SCL
  PB9	I2C1_SDA
- I2C Codec
- SPI Audiuio
- PG9	SPI1_MISO
  PD7	SPI1_MOSI
  PG10	SPI1_NSS
  PG11	SPI1_SCK
- PB4 	DEBUG_JTRST
  PB3 	DEBUG_JTDO-SWO
  PA15 	DEBUG_JTDI
  PA14 	DEBUG_JTCK-SWCLK
  PA13 	DEBUG_JTMS-SWDIO
  GUI_NRST
- PD11	QUADSPI_BK1_IO0
  PD12	QUADSPI_BK1_IO1
  PE2	QUADSPI_BK1_IO2
  PD13	QUADSPI_BK1_IO3
  PG6	QUADSPI_BK1_NCS
  PF10	QUADSPI_CLK
- PC8	SDMMC1_D0
  PC9	SDMMC1_D1
  PC10	SDMMC1_D2
  PC11	SDMMC1_D3
  PC12	SDMMC1_CK
  PD2	SDMMC1_CMD
- PC13-	MY_UI_RESET
  PC6	MY_LCD_RESET
  PA10	MY_SD_DETECT
- PA3	ADC1_INP15
  PA4	ADC1_INP18
  PA5	ADC1_INP19
  PA6	ADC1_INP3
  PA7	ADC1_INP7
  PB0	ADC1_INP9
  PB1	ADC1_INP5
  PC1	ADC1_INP11
  PC4	ADC1_INP4
  PC5	ADC1_INP8
- PA11	USB_OTG_FS_DM
  PA12	USB_OTG_FS_DP
  PA8	USB_OTG_FS_SOF
  PA9	USB_OTG_FS_VBUS
- PE4	SAI1_FS_A
  PE2	SAI1_MCLK_A
  PE5	SAI1_SCK_A
  PE6	SAI1_SD_A
  PE3	SAI1_SD_B
- SPI to UI
- PF8	SPI5_MISO
  PF9	SPI5_MOSI
  PF6	SPI5_NSS
  PF7	SPI5_SCK
- (near C4) PC1	SAI4_SD_A
  PF6	SAI4_SD_B
- PF8	QUADSPI_BK1_IO0
  PF9	QUADSPI_BK1_IO1
  PF7	QUADSPI_BK1_IO2
  PA1	QUADSPI_BK1_IO3
  PG6	QUADSPI_BK1_NCS
  PF10	QUADSPI_CLK
- (near C7) UART4 Debug
- SPI external (optional)
- PD12	I2C4_SCL
  PD13	I2C4_SDA
- SPI PSRAM
- (near C7) PA0	UART4_TX
  PA1	UART4_RX
- PA2	USART2_TX
  PD6	USART2_RX
- UART2 Audio
- PB14	SPI2_MISO
  PB15	SPI2_MOSI
  PB12	SPI2_NSS
  PB13	SPI2_SCK
- AUDIO Tx
- PA2	USART2_TX
  PA3	USART2_RX
- AUDIO Rx
- PF0	FMC_A0
  PF1	FMC_A1
  PF2	FMC_A2
  PF3	FMC_A3
  PF4	FMC_A4
  PF5	FMC_A5
  PF12	FMC_A6
  PF13	FMC_A7
  PF14	FMC_A8
  PF15	FMC_A9
  PG0	FMC_A10
  PG1	FMC_A11
  PE5	FMC_A21
  PE6	FMC_A22
  PG4	FMC_BA0
  PG5	FMC_BA1
  PD14	FMC_D0
  PD15	FMC_D1
  PD0	FMC_D2
  PD1	FMC_D3
  PE7	FMC_D4
  PE8	FMC_D5
  PE9	FMC_D6
  PE10	FMC_D7
  PE11	FMC_D8
  PE12	FMC_D9
  PE13	FMC_D10
  PE14	FMC_D11
  PE15	FMC_D12
  PD8	FMC_D13
  PD9	FMC_D14
  PD10	FMC_D15
  PE0	FMC_NBL0
  PE1	FMC_NBL1
  PC7	FMC_NE1
  PG12	FMC_NE4
  PD4	FMC_NOE
  PD5	FMC_NWE
  PC3_C	FMC_SDCKE0
  PB5	FMC_SDCKE1
  PG8	FMC_SDCLK
  PG15	FMC_SDNCAS
  PC2_C	FMC_SDNE0
  PB6	FMC_SDNE1
- I2C external + display
- PB10	I2C2_SCL
  PB11	I2C2_SDA
- (near U1) Or HY57V64820HGT
- (near U2) Or HY57V64820HGT
- (near U3) Or HY57V64820HGT
- (near U4) Or HY57V64820HGT
- MEMORY
- (near IC3) PSRAM
- SPI MISO LEVEL SHIFTER
- (near J4) FF
- (near IC5) FLASH
- 0 Ohms
- (near IC4) from UI
- (near IC6) FLASH
- (near J8) FF
- (near J5) NF
- (near IC7) EEPROM
- (near J6) NF
- (near IC8) EEPROM
- (near R15) FF
- (near R16) FF
- (near R13) FF
- (near R14) FF

### Library data of the parts
C1 C2 C9 C10 = C0805C225K8RAC7800: CAP CER 2.2UF 10V X7R 0805; manufacturer: KEMET; Tolerance: ±10%; Part Number: C0805C225K8RAC7800; Value: 2.2 µF; Applications: Bypass, Decoupling; Capacitance: 2.2 µF; componentlink1description: Datasheet; componentlink1url: https://api.kemet.com/component-edge/download/datasheet/C0805C225K8RACTU.pdf; componentlink2description: DigiKey Link; componentlink2url: https://www.digikey.com/en/products/detail/kemet/C0805C225K8RAC7800/789654; Device Package: 0805 (2012 Metric); lastupdated: 3/27/2023 7:09:32 PM; Lifecycle Status: Active; Minimum Order: 1; Mounting Type: Surface Mount, MLCC; Operating Temperature: -55°C ~ 125°C; Package / Case: 0805 (2012 Metric); packaging: TapeAndReel; partid: 32363; Part Status: Active; price: 0.03; series: SMD Comm X7R; Size / Dimension: 0.079" L x 0.049" W (2.00mm x 1.25mm); Supplier 1: DigiKey; Supplier Part Number 1: 399-C0805C225K8RAC7800CT-ND; Temperature Coefficient: X7R; Thickness (Max): 0.055" (1.40mm); Voltage - Rated: 10V
C3-C6 = CBR08C909CAGAC: CAP CER 9PF 250V C0G/NP0 0805; Manufacturer: KEMET; Temperature Coefficient: C0G, NP0; Tolerance: ±0.25pF; Part Number: CBR08C909CAGAC; Value: 9pF; Applications: RF, Microwave, High Frequency; Capacitance: 9pF; ComponentLink1Description: Datasheet; ComponentLink1URL: https://api.kemet.com/component-edge/download/datasheet/CBR08C909CAGAC.pdf; ComponentLink2Description: DigiKey Link; ComponentLink2URL: http://digikey.com/product-detail/en/kemet/CBR08C909CAGAC/399-8711-1-ND/3480335; Device Package: 0805 (2012 Metric); Features: High Q, Low Loss, Ultra Low ESR; LastUpdated: 9/2/2020 1:04:31 AM; Lifecycle Status: Active; Minimum Order: 1; Mounting Type: Surface Mount, MLCC; Operating Temperature: -55°C ~ 125°C; Package / Case: 0805 (2012 Metric); Packaging: TapeAndReel; PartId: 8592; Part Status: Active; Price: 0.28; Series: CBR-SMD RF C0G; Size / Dimension: 0.079" L x 0.049" W (2.00mm x 1.25mm); Supplier 1: DigiKey; Supplier Part Number 1: 399-8711-1-ND; Thickness (Max): 0.035" (0.88mm); Voltage - Rated: 250V
C7 C8 C11-C60 = C0402C104K4RACAUTO: CAP CER 0.1UF 16V X7R 0402; Manufacturer: KEMET; Tolerance: ±10%; Part Number: C0402C104K4RACAUTO; Value: 0.1µF; Applications: Automotive, Bypass, Decoupling; Capacitance: 0.1µF; ComponentLink1Description: Datasheet; ComponentLink1URL: https://api.kemet.com/component-edge/download/specsheet/C0402C104K4RACAUTO.pdf; ComponentLink2Description: DigiKey Link; ComponentLink2URL: http://digikey.com/product-detail/en/kemet/C0402C104K4RACAUTO/399-6828-1-ND/3314343; Device Package: 0402 (1005 Metric); LastUpdated: 9/2/2020 1:02:21 AM; Lifecycle Status: Active; Minimum Order: 1; Mounting Type: Surface Mount, MLCC; Operating Temperature: -55°C ~ 125°C; Package / Case: 0402 (1005 Metric); Packaging: TapeAndReel; PartId: 3024; Part Status: Active; Price: 0.01; Ratings: AEC-Q200; Series: SMD Auto X7R; Size / Dimension: 0.039" L x 0.020" W (1.00mm x 0.50mm); Supplier 1: DigiKey; Supplier Part Number 1: 399-6828-1-ND; Temperature Coefficient: X7R; Thickness (Max): 0.022" (0.55mm); Voltage - Rated: 16V
C61-C66 = C0805C106K8PAC7800: CAP CER 10UF 10V X5R 0805; manufacturer: KEMET; Tolerance: ±10%; Part Number: C0805C106K8PAC7800; Value: 10 µF; Applications: Bypass, Decoupling; Capacitance: 10 µF; componentlink1description: Datasheet; componentlink1url: https://connect.kemet.com:7667/gateway/IntelliData-ComponentDocumentation/1.0/download/datasheet/C0805C106K8PACTU; componentlink2description: DigiKey Link; componentlink2url: https://www.digikey.com/en/products/detail/kemet/C0805C106K8PAC7800/1090830; Device Package: 0805 (2012 Metric); lastupdated: 9/19/2022 1:03:23 PM; Lifecycle Status: Active; Minimum Order: 1; Mounting Type: Surface Mount, MLCC; Operating Temperature: -55°C ~ 85°C; Package / Case: 0805 (2012 Metric); packaging: TapeAndReel; partid: 44790; Part Status: Active; price: 0.02; series: SMD Comm X5R; Size / Dimension: 0.079" L x 0.049" W (2.00mm x 1.25mm); Supplier 1: DigiKey; Supplier Part Number 1: 399-C0805C106K8PAC7800CT-ND; Temperature Coefficient: X5R; Thickness (Max): 0.055" (1.40mm); Voltage - Rated: 10V
C67 C68 = CC0805DRNPO9BN7R0: CAP CER 7PF 50V C0G/NPO 0805; manufacturer: Yageo; Temperature Coefficient: C0G, NP0; Tolerance: ±0.5pF; Part Number: CC0805DRNPO9BN7R0; Value: 7 pF; Applications: General Purpose; Capacitance: 7 pF; componentlink1description: Datasheet; componentlink1url: https://www.yageo.com/upload/media/product/productsearch/datasheet/mlcc/UPY-GP_NP0_16V-to-50V_17.pdf; componentlink2description: DigiKey Link; componentlink2url: https://www.digikey.com/en/products/detail/yageo/CC0805DRNPO9BN7R0/302830; Device Package: 0805 (2012 Metric); lastupdated: 9/8/2023 7:12:10 PM; Lifecycle Status: Active; Minimum Order: 1; Mounting Type: Surface Mount, MLCC; Operating Temperature: -55°C ~ 125°C; Package / Case: 0805 (2012 Metric); packaging: TapeAndReel; partid: 8360; Part Status: Active; price: 0.01; series: CC; Size / Dimension: 0.079" L x 0.049" W (2.00mm x 1.25mm); Supplier 1: DigiKey; Supplier Part Number 1: 311-1096-1-ND; Thickness (Max): 0.024" (0.60mm); Voltage - Rated: 50V
IC1 IC2 = STM32H743ZIT6U: Integrated Circuit; Manufacturer_Name: STMicroelectronics; Datasheet Link: https://componentsearchengine.com/Datasheets/1/STM32H743ZIT6U.pdf; Height: 1.6mm; Manufacturer_Part_Number: STM32H743ZIT6U; Mouser Part Number: N/A; Mouser Price/Stock: https://www.mouser.co.uk/ProductDetail/STMicroelectronics/STM32H743ZIT6U?qs=PzGy0jfpSMtTUBlZwwPqMQ%3D%3D
IC3 = LY68L6400SLIT: Integrated Circuit; Manufacturer_Name: Lyontek Inc.; Datasheet Link: https://datasheet.lcsc.com/szlcsc/Lyontek-Inc-LY68L6400SLIT_C261881.pdf; Height: 1.75mm; Manufacturer_Part_Number: LY68L6400SLIT
IC4 = SN74LVC1G125DBVR: Integrated Circuit; Manufacturer_Name: Texas Instruments; Datasheet Link: http://www.ti.com/lit/ds/symlink/sn74lvc1g125.pdf; Height: 1.45mm; Manufacturer_Part_Number: SN74LVC1G125DBVR; Mouser Part Number: 595-SN74LVC1G125DBVR; Mouser Price/Stock: https://www.mouser.co.uk/ProductDetail/Texas-Instruments/SN74LVC1G125DBVR?qs=dT9u2OTAaVWCjkJK89JQQg%3D%3D; Arrow Part Number: SN74LVC1G125DBVR; Arrow Price/Stock: https://www.arrow.com/en/products/sn74lvc1g125dbvr/texas-instruments?region=nac
IC5 IC6 = N25Q128A13ESE40F: Integrated Circuit; Manufacturer_Name: Micron; Datasheet Link: https://datasheet.datasheetarchive.com/originals/distributors/Datasheets-DGA23/1494983.pdf; Height: 2.16mm; Manufacturer_Part_Number: N25Q128A13ESE40F; Mouser Part Number: 340-182267; Mouser Price/Stock: https://www.mouser.co.uk/ProductDetail/Micron/N25Q128A13ESE40F?qs=taEdVNyAfdHw8xv9Y4zfpQ%3D%3D; Arrow Part Number: N25Q128A13ESE40F; Arrow Price/Stock: https://www.arrow.com/en/products/n25q128a13ese40f/micron-technology
IC7 IC8 = AT24C128BN-SH-B: Integrated Circuit; Manufacturer_Name: Microchip; Datasheet Link: https://componentsearchengine.com/Datasheets/1/AT24C128BN-SH-B.pdf; Height: 1.75mm; Manufacturer_Part_Number: AT24C128BN-SH-B; Mouser Part Number: 556-A24C128BNSH-B; Mouser Price/Stock: https://www.mouser.co.uk/ProductDetail/Microchip-Technology-Atmel/AT24C128BN-SH-B?qs=j6lVIf5KywAfpl9r4qbAuQ%3D%3D
J1-J3 = DF9-41P-1V_32_: Connector; Manufacturer_Name: Hirose; Manufacturer_Part_Number: DF9-41P-1V(32); Datasheet Link: http://componentsearchengine.com/Datasheets/1/DF9-41P-1V(32).pdf; Mouser Part Number: 798-DF9-41P-1V32; Mouser Price/Stock: https://www.mouser.co.uk/ProductDetail/Hirose-Connector/DF9-41P-1V32?qs=zOgoZG1CgI%252BzVCgniEkwOw%3D%3D; Arrow Part Number: DF9-41P-1V(32); Arrow Price/Stock: https://www.arrow.com/en/products/df9-41p-1v-32/hirose-electric
J4-J6 J8 = Jumper_double: CommentText: "Перемычка"
R1 R2 R5-R7 R9 R10 R12 = RT0603FRE0710KL: RES SMD 10K OHM 1% 1/10W 0603; Manufacturer: Yageo; Power (Watts): 0.1W, 1/10W; Temperature Coefficient: ±50ppm/°C; Part Number: RT0603FRE0710KL; Value: 10 kOhms; ComponentLink1Description: Datasheet; ComponentLink1URL: https://www.yageo.com/upload/media/product/productsearch/datasheet/rchip/PYu-RT_1-to-0.01_RoHS_L_11.pdf; ComponentLink2Description: DigiKey Link; ComponentLink2URL: http://digikey.com/product-detail/en/yageo/RT0603FRE0710KL/YAG2321CT-ND/5252435; Composition: Thin Film; Device Package: 0603 (1608 Metric); Height - Seated (Max): 0.022" (0.55mm); LastUpdated: 9/2/2020 1:10:23 AM; Lifecycle Status: Active; Minimum Order: 1; Number of Terminations: 2; Operating Temperature: -55°C ~ 155°C; Package / Case: 0603 (1608 Metric); Packaging: TapeAndReel; PartId: 5671; Part Status: Active; Price: 0.01; Resistance: 10 kOhms; Series: RT; Size / Dimension: 0.063" L x 0.031" W (1.60mm x 0.80mm); Supplier 1: DigiKey; Supplier Part Number 1: YAG2321CT-ND; Supplier Device Package: 0603; Tolerance: ±1%
R3 R4 R8 = RT0402FRE07100RL: RES SMD 100 OHM 1% 1/16W 0402; Manufacturer: Yageo; Power (Watts): 0.063W, 1/16W; Temperature Coefficient: ±50ppm/°C; Part Number: RT0402FRE07100RL; Value: 100 Ohms; ComponentLink1Description: Datasheet; ComponentLink1URL: https://www.yageo.com/upload/media/product/productsearch/datasheet/rchip/PYu-RT_1-to-0.01_RoHS_L_11.pdf; ComponentLink2Description: DigiKey Link; ComponentLink2URL: http://digikey.com/product-detail/en/yageo/RT0402FRE07100RL/YAG3342CT-ND/5418047; Composition: Thin Film; Device Package: 0402 (1005 Metric); Height - Seated (Max): 0.014" (0.35mm); LastUpdated: 9/2/2020 1:08:09 AM; Lifecycle Status: Active; Minimum Order: 1; Number of Terminations: 2; Operating Temperature: -55°C ~ 155°C; Package / Case: 0402 (1005 Metric); Packaging: TapeAndReel; PartId: 3193; Part Status: Active; Price: 0.01; Resistance: 100 Ohms; Series: RT; Size / Dimension: 0.039" L x 0.020" W (1.00mm x 0.50mm); Supplier 1: DigiKey; Supplier Part Number 1: YAG3342CT-ND; Supplier Device Package: 0402; Tolerance: ±1%
R13-R16 = RT0603DRE075K6L: RES SMD 5.6K OHM 0.5% 1/10W 0603; Manufacturer: Yageo; Power (Watts): 0.1W, 1/10W; Temperature Coefficient: ±50ppm/°C; Part Number: RT0603DRE075K6L; Value: 5.6 kOhms; ComponentLink1Description: Datasheet; ComponentLink1URL: https://www.yageo.com/upload/media/product/productsearch/datasheet/rchip/PYu-RT_1-to-0.01_RoHS_L_11.pdf; ComponentLink2Description: DigiKey Link; ComponentLink2URL: http://digikey.com/product-detail/en/yageo/RT0603DRE075K6L/311-2635-1-ND/6129054; Composition: Thin Film; Device Package: 0603 (1608 Metric); Height - Seated (Max): 0.022" (0.55mm); LastUpdated: 9/2/2020 1:10:05 AM; Lifecycle Status: Active; Minimum Order: 1; Number of Terminations: 2; Operating Temperature: -55°C ~ 155°C; Package / Case: 0603 (1608 Metric); Packaging: TapeAndReel; PartId: 14197; Part Status: Active; Price: 0.01; Resistance: 5.6 kOhms; Series: RT; Size / Dimension: 0.063" L x 0.031" W (1.60mm x 0.80mm); Supplier 1: DigiKey; Supplier Part Number 1: 311-2635-1-ND; Supplier Device Package: 0603; Tolerance: ±0.5%
TP1 TP2 = TestPoint
Y1 Y2 = NX3225SA-24MHZ-EXS00A-CS07532: CRYSTAL 24MHZ 9PF SMD; Manufacturer: NDK America, Inc.; ESR (Equivalent Series Resistance): 100 Ohms; Operating Mode: Fundamental; Part Number: NX3225SA-24MHZ-EXS00A-CS07532; ComponentLink2Description: DigiKey Link; ComponentLink2URL: http://digikey.com/product-detail/en/ndk-america-inc/NX3225SA-24MHZ-EXS00A-CS07532/644-1393-1-ND/9172121; Frequency: 24MHz; Height - Seated (Max): 0.024" (0.60mm); LastUpdated: 9/2/2020 1:21:59 AM; Lifecycle Status: Active; Load Capacitance: 9pF; Minimum Order: 1; Mounting Type: Surface Mount; Operating Temperature: -40°C ~ 150°C; Package / Case: 4-SMD, No Lead; Packaging: TapeAndReel; PartId: 571; Part Status: Active; Price: 0.38; Ratings: AEC-Q200; Series: NX3225SA; Size / Dimension: 0.126" L x 0.098" W (3.20mm x 2.50mm); Supplier 1: DigiKey; Supplier Part Number 1: 644-1393-1-ND; Type: MHz Crystal; Value: 24MHz
Y3 = ABS07-32.768KHZ-7-T: Crystal or Oscillator; Manufacturer_Name: ABRACON; Datasheet Link: https://abracon.com/Resonators/ABS07.pdf; Height: 0.9mm; Manufacturer_Part_Number: ABS07-32.768KHZ-7-T; Mouser Part Number: 815-ABS07-32.768K7T; Mouser Price/Stock: https://www.mouser.co.uk/ProductDetail/ABRACON/ABS07-32.768KHZ-7-T?qs=2nyfZ6BV3oibNEFok2qBLA%3D%3D; Arrow Part Number: ABS07-32.768KHZ-7-T; Arrow Price/Stock: https://www.arrow.com/en/products/abs07-32.768khz-7-t/abracon?region=nac